# EAGLE schematic TTR1 Gr4 - SIMON Timothée Pic (EAGLE 7.6.0)
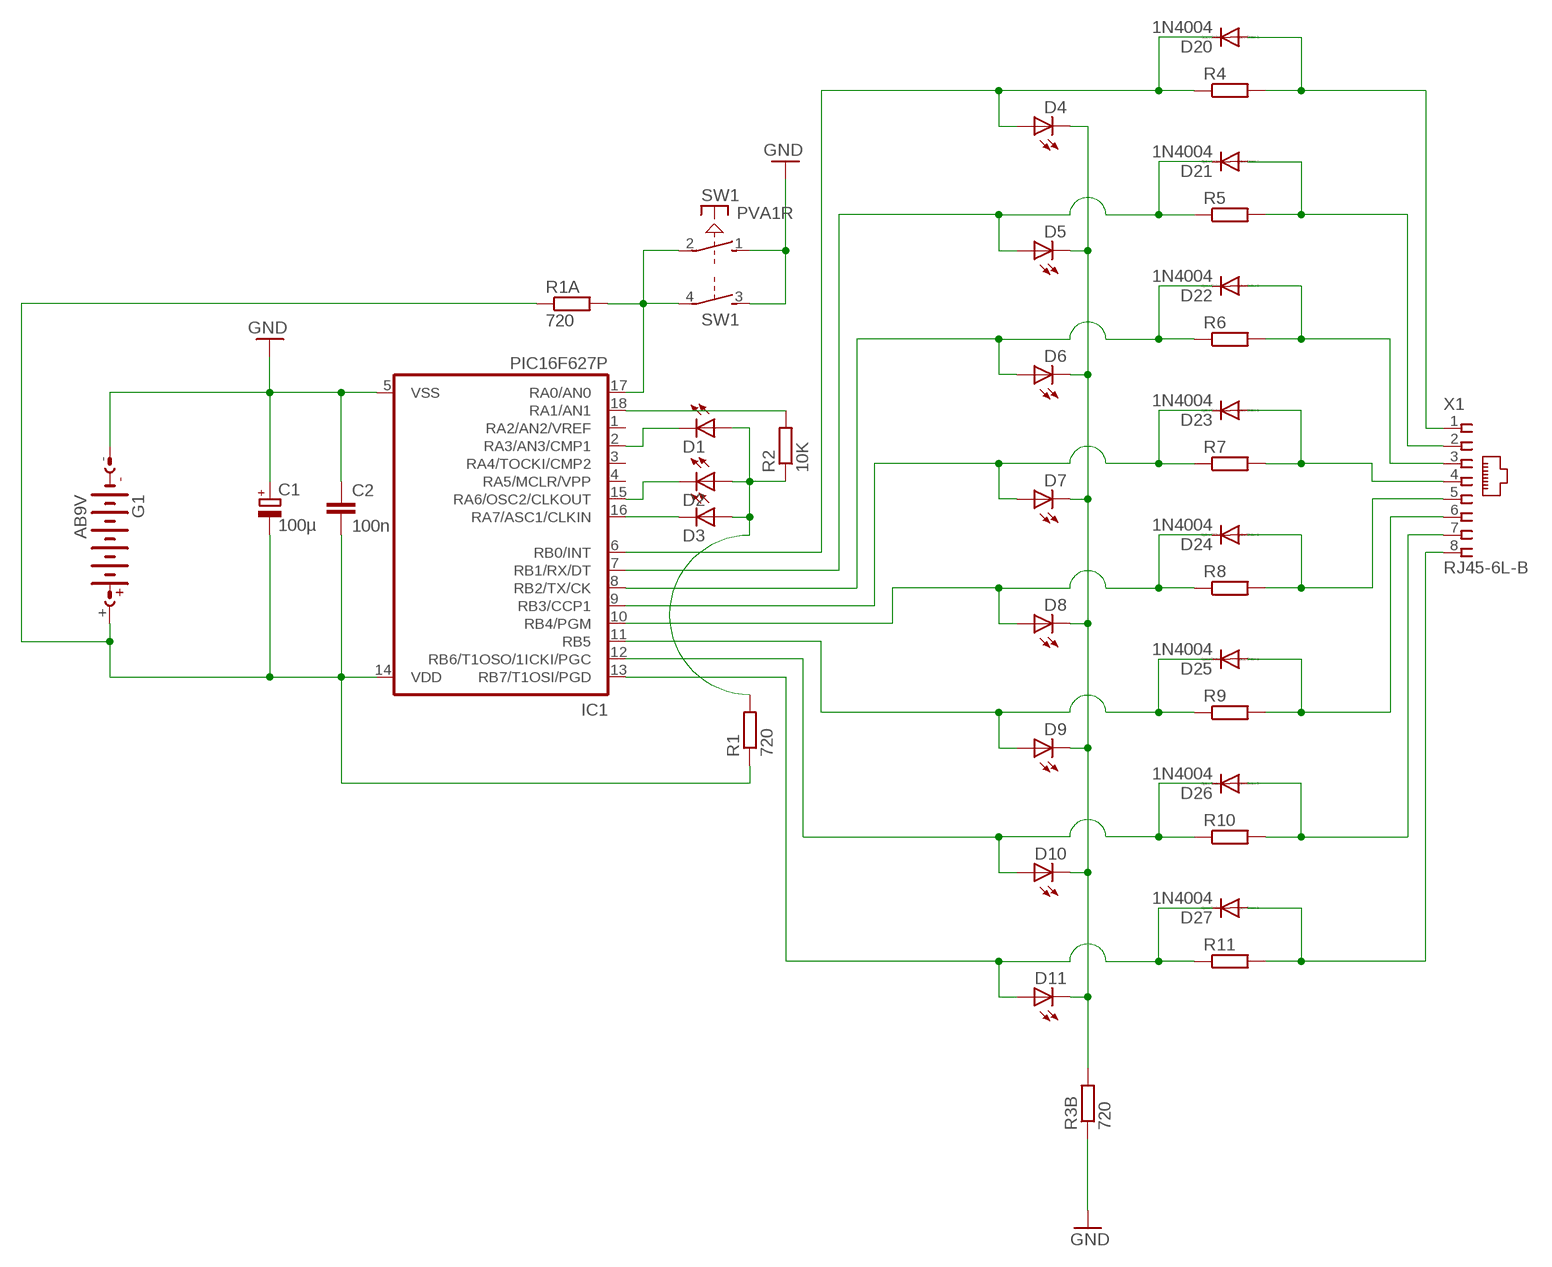
[diagram p0: schematic, sheet 1]

## Parts
C1  100µ  CPOL-EUE5-6  [E5-6]
C2  100n  C-EU050-024X044  [C050-024X044]
D1  LED5MM  [LED5MM]
D2  LED5MM  [LED5MM]
D3  LED5MM  [LED5MM]
D4  LED5MM  [LED5MM]
D5  LED5MM  [LED5MM]
D6  LED5MM  [LED5MM]
D7  LED5MM  [LED5MM]
D8  LED5MM  [LED5MM]
D9  LED5MM  [LED5MM]
D10  LED5MM  [LED5MM]
D11  LED5MM  [LED5MM]
D20  1N4004  [DO41-10]
D21  1N4004  [DO41-10]
D22  1N4004  [DO41-10]
D23  1N4004  [DO41-10]
D24  1N4004  [DO41-10]
D25  1N4004  [DO41-10]
D26  1N4004  [DO41-10]
D27  1N4004  [DO41-10]
G1  AB9V  [AB9V]
IC1  PIC16F627P  [DIL18]
R1  720  R-EU_0204/7  [0204/7]
R1A  720  R-EU_0204/7  [0204/7]
R2  10K  R-EU_0204/7  [0204/7]
R3B  720  R-EU_0204/7  [0204/7]
R4  R-EU_0204/7  [0204/7]
R5  R-EU_0204/7  [0204/7]
R6  R-EU_0204/7  [0204/7]
R7  R-EU_0204/7  [0204/7]
R8  R-EU_0204/7  [0204/7]
R9  R-EU_0204/7  [0204/7]
R10  R-EU_0204/7  [0204/7]
R11  R-EU_0204/7  [0204/7]
SW1  PVA1R  [PVA1R]
X1  RJ45-6L-B  [RJ45-NO-SHIELD]

## Nets
D20: D4.A D20.C IC1.6(RB0/INT) R4.1
GND: C1.+ C2.1 G1.- IC1.5(VSS) R3B.1 SW1.1(1:S) SW1.3(2:S)
N$1: D5.A D21.C IC1.7(RB1/RX/DT) R5.1
N$2: D2.K(C) IC1.15(RA6/OSC2/CLKOUT)
N$3: IC1.18(RA1/AN1) R2.2
N$4: D7.A D23.C IC1.9(RB3/CCP1) R7.1
N$5: IC1.17(RA0/AN0) R1A.2 SW1.2(1:P) SW1.4(2:P)
N$6: D1.A D2.A D3.A R1.2 R2.1
N$7: D21.A R5.2 X1.2
N$8: D1.K(C) IC1.2(RA3/AN3/CMP1)
N$9: D9.A D25.C IC1.11(RB5) R9.1
N$11: D3.K(C) IC1.16(RA7/ASC1/CLKIN)
N$12: D6.A D22.C IC1.8(RB2/TX/CK) R6.1
N$13: D23.A R7.2 X1.4
N$14: D20.A R4.2 X1.1
N$15: D8.A D24.C IC1.10(RB4/PGM) R8.1
N$16: D25.A R9.2 X1.6
N$17: D26.A R10.2 X1.7
N$18: D4.K(C) D5.K(C) D6.K(C) D7.K(C) D8.K(C) D9.K(C) D10.K(C) D11.K(C) R3B.2
N$19: D24.A R8.2 X1.5
N$21: D27.A R11.2 X1.8
N$23: C1.- C2.2 G1.+ IC1.14(VDD) R1.1 R1A.1
N$25: D10.A D26.C IC1.12(RB6/T1OSO/1ICKI/PGC) R10.1
N$27: D22.A R6.2 X1.3
N$29: D11.A D27.C IC1.13(RB7/T1OSI/PGD) R11.1
Unconnected: IC1.1(RA2/AN2/VREF) IC1.3(RA4/TOCKI/CMP2) IC1.4(RA5/MCLR/VPP)

## Library data of the parts
C1 = resistor:CPOL-EU: POLARIZED CAPACITOR, European symbol
C2 = resistor:C-EU: CAPACITOR, European symbol
D1-D11 = led:LED: LED OSRAM: - CHIPLED LG R971, LG N971, LY N971, LG Q971, LY Q971, LO R971, LY R971 LH N974, LH R974 LS Q976, LO Q976, LY Q976 LO Q996 - Hyper CHIPLED LW Q18S LB Q993, LB Q99A, LB R99A - SideLED LS A670, LO A670, LY A670, LG A670, LP A670 LB A673, LV A673, LT A673, LW A673 LH A674 LY A675 LS A676, LA A676, LO A676, LY A676, LW A676 LS A679, LY A679, LG A679 - Hyper Micro SIDELED® LS Y876, LA Y876, LO Y876, LY Y876 LT Y87S - SmartLED LW L88C, LW L88S LB L89C, LB L89S, LG L890 LS L89K, LO L89K, LY L89K LS L896, LA L896, LO L896, LY L896 - TOPLED LS T670, LO T670, LY T670, LG T670, LP T670 LSG T670, LSP T670, LSY T670, LOP T670, LYG T670 LG T671, LOG T671, LSG T671 LB T673, LV T673, LT T673, LW T673 LH T674 LS T676, LA T676, LO T676, LY T676, LB T676, LH T676, LSB T676, LW T676 LB T67C, LV T67C, LT T67C, LS T67K, LO T67K, LY T67K, LW E67C LS E67B, LA E67B, LO E67B, LY E67B, LB E67C, LV E67C, LT E67C LW T67C LS T679, LY T679, LG T679 LS T770, LO T770, LY T770, LG T770, LP T770 LB T773, LV T773, LT T773, LW T773 LH T774 LS E675, LA E675, LY E675, LS T675 LS T776, LA T776, LO T776, LY T776, LB T776 LHGB T686 LT T68C, LB T68C - Hyper Mini TOPLED® LB M676 - Mini TOPLED Santana® LG M470 LS M47K, LO M47K, LY M47K Source: http://www.osram.convergy.de LUXEON: - LUMILED® LXK2-PW12-R00, LXK2-PW12-S00, LXK2-PW14-U00, LXK2-PW14-V00 LXK2-PM12-R00, LXK2-PM12-S00, LXK2-PM14-U00 LXK2-PE12-Q00, LXK2-PE12-R00, LXK2-PE12-S00, LXK2-PE14-T00, LXK2-PE14-U00 LXK2-PB12-K00, LXK2-PB12-L00, LXK2-PB12-M00, LXK2-PB14-N00, LXK2-PB14-P00, LXK2-PB14-Q00 LXK2-PR12-L00, LXK2-PR12-M00, LXK2-PR14-Q00, LXK2-PR14-R00 LXK2-PD12-Q00, LXK2-PD12-R00, LXK2-PD12-S00 LXK2-PH12-R00, LXK2-PH12-S00 LXK2-PL12-P00, LXK2-PL12-Q00, LXK2-PL12-R00 Source: www.luxeon.com KINGBRIGHT: KA-3528ASYC Source: www.kingbright.com
D20-D27 = diode:1N4004: DIODE general purpose rectifier, 1 A
G1 = battery:AB9V: 9-V BATTERY CLIP
IC1 = microchip:PIC16*F62: FLASH-Based 8-Bit CMOS Microcontroller Source: http://ww1.microchip.com/downloads/en/DeviceDoc/40300C.pdf; MF: MICROCHIP; MPN: PIC16F627-20I/P; OC_FARNELL: 1084298; OC_NEWARK: 23C4967
R1 R1A R2 R3B R4-R11 = resistor:R-EU_: RESISTOR, European symbol
SW1 = switch-misc:PVA1R: ITT SWITCH
X1 = con-tycoelectronics:RJ45: CORCOM Modular RJ Jacks No Shield Source: www.tycoelectronics.com .. ENG_DS_1654001_1099_RJ_L_0507.pdf; MPN: RJ45-6L-B; OC_FARNELL: unknown; OC_NEWARK: 16R6090

## Net classes
0 default: width 2 mm, drill 0.8 mm, clearance 0.2 mm